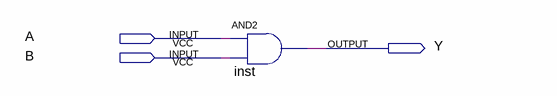
[diagram p0: schematic sheet]
// Quartus schematic AndGate_scheme.bdf as structural Verilog: 1 symbols, 3 pins
module AndGate_scheme (
  input  A,
  input  B,
  output Y
);

  and inst (Y, A, B);
endmodule
